# EAGLE design LB_BIT_i30_KEYBOARD-v03(3_4)-OHW (EAGLE 6.6.0)
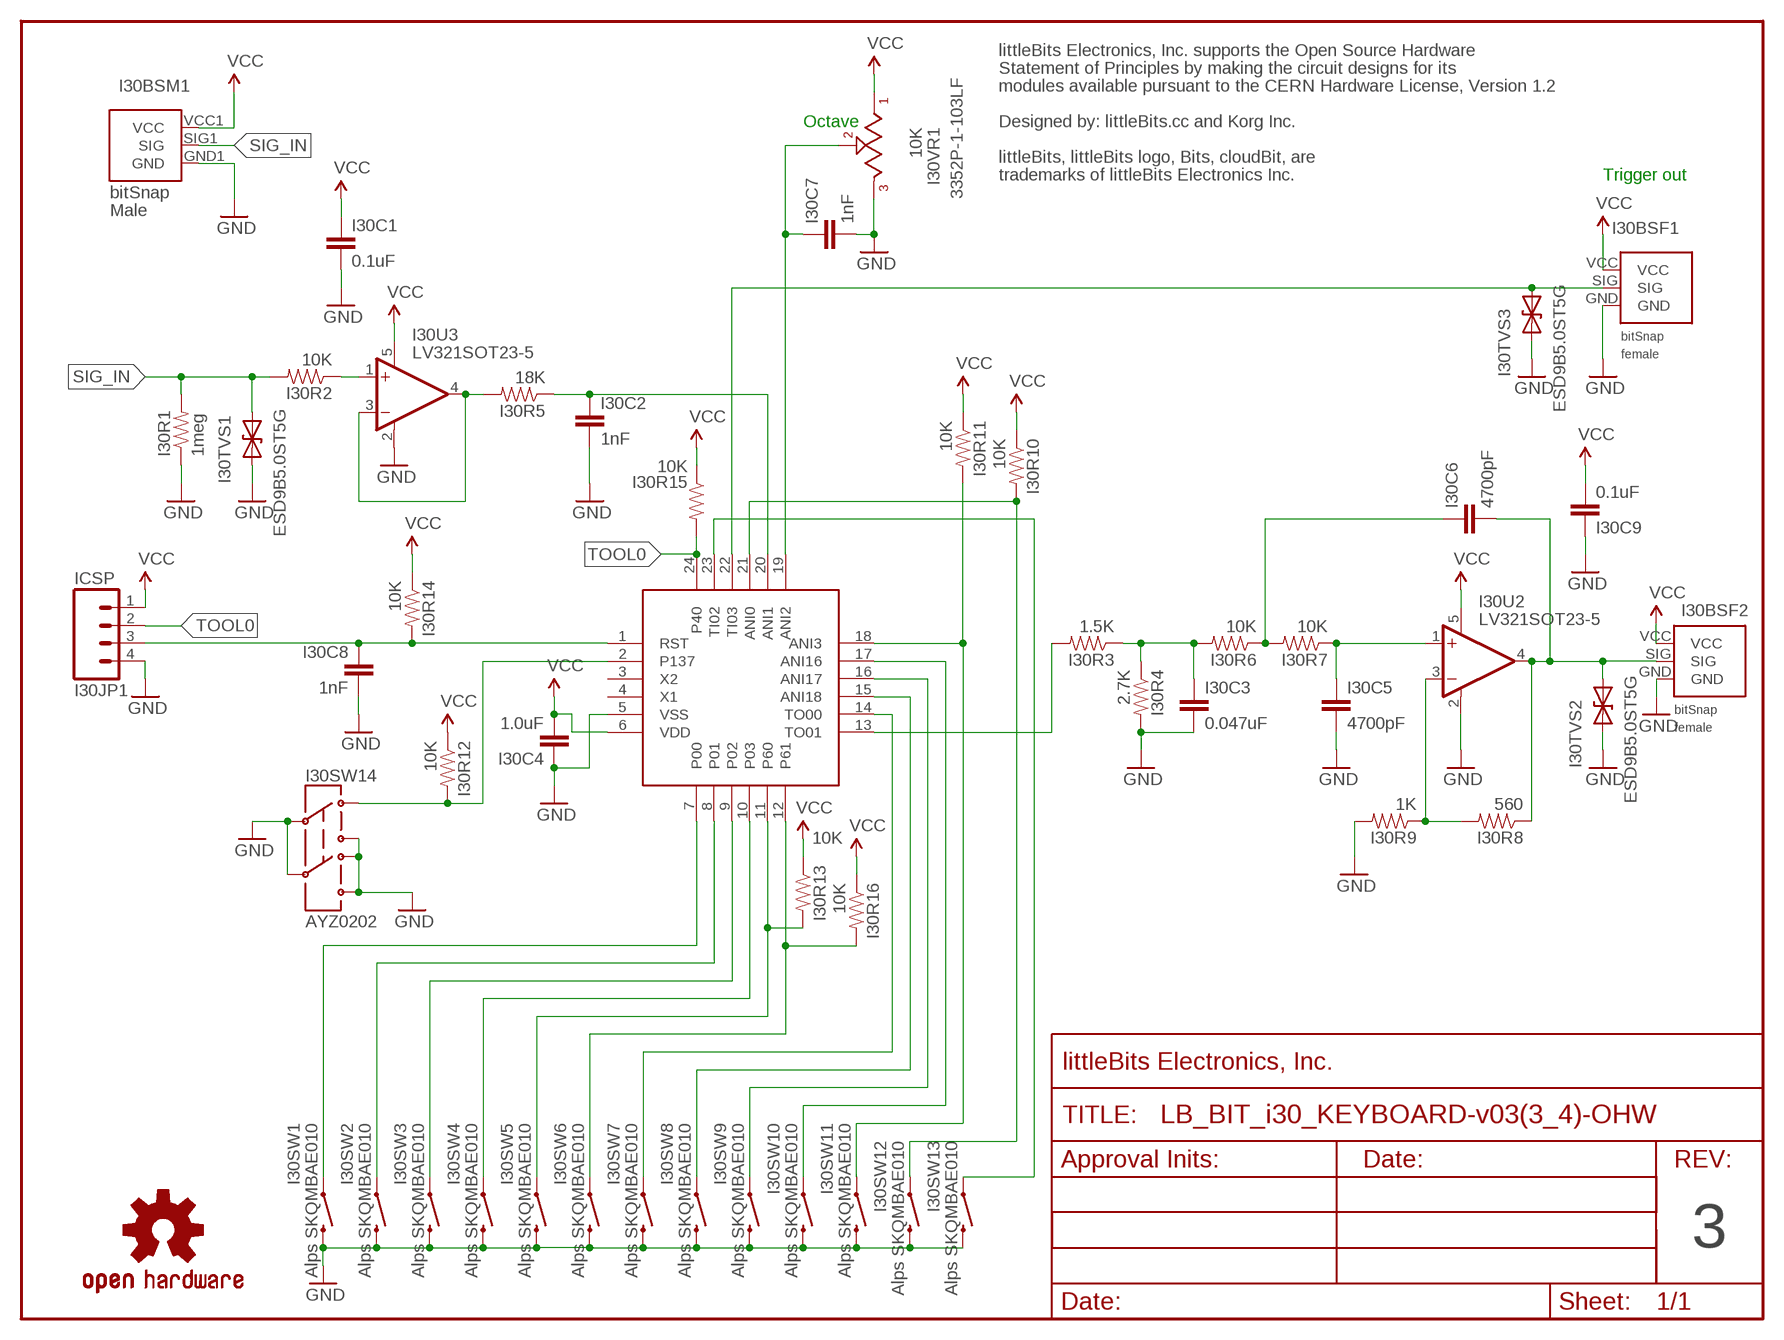
[diagram p0: schematic, sheet 1]

## Parts
FRAME1  FRAME-LETTER-OHWOHW  [FABDWG01-OHW]
I30BSF1  BITSNAP_V03_FEMALE  [BITSNAP_V03_FEMALE]
I30BSF2  BITSNAP_V03_FEMALE  [BITSNAP_V03_FEMALE]
I30BSM1  BITSNAP_V03_MALE  [BITSNAP_V03_MALE]
I30C1  0.1uF  CAPCAP-0603  [CAP-0603]
I30C2  1nF  CAPCAP-0603  [CAP-0603]
I30C3  0.047uF  CAPCAP-0603  [CAP-0603]
I30C4  1.0uF  CAPCAP-0603  [CAP-0603]
I30C5  4700pF  CAPCAP-0603  [CAP-0603]
I30C6  4700pF  CAPCAP-0603  [CAP-0603]
I30C7  1nF  CAPCAP-0603  [CAP-0603]
I30C8  1nF  CAPCAP-0603  [CAP-0603]
I30C9  0.1uF  CAPCAP-0603  [CAP-0603]
I30JP1  ICSP  HDR-4SM_SML  [SIP4-SM-0.1IN-NOS.S.]
I30R1  1meg  RESISTOR0603  [RES-0603]
I30R2  10K  RESISTOR0603  [RES-0603]
I30R3  1.5K  RESISTOR0603  [RES-0603]
I30R4  2.7K  RESISTOR0603  [RES-0603]
I30R5  18K  RESISTOR0603  [RES-0603]
I30R6  10K  RESISTOR0603  [RES-0603]
I30R7  10K  RESISTOR0603  [RES-0603]
I30R8  560  RESISTOR0603  [RES-0603]
I30R9  1K  RESISTOR0603  [RES-0603]
I30R10  10K  RESISTOR0603  [RES-0603]
I30R11  10K  RESISTOR0603  [RES-0603]
I30R12  10K  RESISTOR0603  [RES-0603]
I30R13  10K  RESISTOR0603  [RES-0603]
I30R14  10K  RESISTOR0603  [RES-0603]
I30R15  10K  RESISTOR0603  [RES-0603]
I30R16  10K  RESISTOR0603  [RES-0603]
I30SW1  Alps SKQMBAE010  SWITCH-MOMENTARY-2EVQ  [TACTILE-SWITCH-EVQ-PE104K]
I30SW2  Alps SKQMBAE010  SWITCH-MOMENTARY-2EVQ  [TACTILE-SWITCH-EVQ-PE104K]
I30SW3  Alps SKQMBAE010  SWITCH-MOMENTARY-2EVQ  [TACTILE-SWITCH-EVQ-PE104K]
I30SW4  Alps SKQMBAE010  SWITCH-MOMENTARY-2EVQ  [TACTILE-SWITCH-EVQ-PE104K]
I30SW5  Alps SKQMBAE010  SWITCH-MOMENTARY-2EVQ  [TACTILE-SWITCH-EVQ-PE104K]
I30SW6  Alps SKQMBAE010  SWITCH-MOMENTARY-2EVQ  [TACTILE-SWITCH-EVQ-PE104K]
I30SW7  Alps SKQMBAE010  SWITCH-MOMENTARY-2EVQ  [TACTILE-SWITCH-EVQ-PE104K]
I30SW8  Alps SKQMBAE010  SWITCH-MOMENTARY-2EVQ  [TACTILE-SWITCH-EVQ-PE104K]
I30SW9  Alps SKQMBAE010  SWITCH-MOMENTARY-2EVQ  [TACTILE-SWITCH-EVQ-PE104K]
I30SW10  Alps SKQMBAE010  SWITCH-MOMENTARY-2EVQ  [TACTILE-SWITCH-EVQ-PE104K]
I30SW11  Alps SKQMBAE010  SWITCH-MOMENTARY-2EVQ  [TACTILE-SWITCH-EVQ-PE104K]
I30SW12  Alps SKQMBAE010  SWITCH-MOMENTARY-2EVQ  [TACTILE-SWITCH-EVQ-PE104K]
I30SW13  Alps SKQMBAE010  SWITCH-MOMENTARY-2EVQ  [TACTILE-SWITCH-EVQ-PE104K]
I30SW14  AYZ0202  [AYZ0202]
I30TVS1  ESD9B5.0ST5G  DIODE-TVSSOD-923  [SOD-923]
I30TVS2  ESD9B5.0ST5G  DIODE-TVSSOD-923  [SOD-923]
I30TVS3  ESD9B5.0ST5G  DIODE-TVSSOD-923  [SOD-923]
I30U1  R5F10278QFN-24  [QFN-24(4MM)]
I30U2  LV321SOT23-5  [SOT23-5]
I30U3  LV321SOT23-5  [SOT23-5]
I30VR1  10K  THUMBPOT-BOURNS_3352P  [THUMBPOT-BOURNS_3352]
U$1  OSHW-LOGOL  [OSHW-LOGO-L]
U$2  OSHWCREDIT-KORG  [OSHWCREDIT-KORG]

## Nets
GND: I30BSF1.GND I30BSF2.GND I30BSM1.GND1(GND) I30C1.2 I30C2.2 I30C3.2 I30C4.1 I30C5.2 I30C7.2 I30C8.2 I30C9.1 I30JP1.4 I30R1.1 I30R4.2 I30R9.2 I30SW1.P$2 I30SW2.P$2 I30SW3.P$2 I30SW4.P$2 I30SW5.P$2 I30SW6.P$2 I30SW7.P$2 I30SW8.P$2 I30SW9.P$2 I30SW10.P$2 I30SW11.P$2 I30SW12.P$2 I30SW13.P$2 I30SW14.2 I30SW14.3 I30SW14.4 I30SW14.5 I30SW14.6 I30TVS1.1(A) I30TVS2.1(A) I30TVS3.1(A) I30U1.5(VSS) I30U2.2(V-) I30U3.2(V-) I30VR1.1
N$1: I30C2.1 I30R5.1 I30U1.20(ANI1)
N$2: I30R5.2 I30U3.3(-IN) I30U3.4(OUT)
N$3: I30C3.1 I30R3.1 I30R4.1 I30R6.2
N$4: I30R2.1 I30U3.1(+IN)
N$5: I30R3.2 I30U1.13(TO01)
N$6: I30R8.2 I30R9.1 I30U2.3(-IN)
N$7: I30C6.1 I30R6.1 I30R7.2
N$8: I30BSF1.SIG I30TVS3.2(C) I30U1.22(TI03)
N$9: I30SW13.P$1 I30U1.23(TI02)
N$10: I30C5.1 I30R7.1 I30U2.1(+IN)
N$11: I30R12.2 I30SW14.1 I30U1.2(P137)
N$12: I30R10.2 I30SW12.P$1 I30U1.21(ANI0)
N$13: I30R11.2 I30SW11.P$1 I30U1.18(ANI3)
N$14: I30SW10.P$1 I30U1.17(ANI16)
N$15: I30SW9.P$1 I30U1.16(ANI17)
N$16: I30SW8.P$1 I30U1.15(ANI18)
N$17: I30SW7.P$1 I30U1.14(TO00)
N$18: I30R16.2 I30SW6.P$1 I30U1.12(P61)
N$19: I30R13.2 I30SW5.P$1 I30U1.11(P60)
N$20: I30SW4.P$1 I30U1.10(P03)
N$21: I30SW3.P$1 I30U1.9(P02)
N$22: I30SW2.P$1 I30U1.8(P01)
N$23: I30SW1.P$1 I30U1.7(P00)
N$27: I30C7.1 I30U1.19(ANI2) I30VR1.2
N$31: I30C8.1 I30JP1.3 I30R14.2 I30U1.1(RST)
SIG_IN: I30BSM1.SIG1(SIG) I30R1.2 I30R2.2 I30TVS1.2(C)
SIG_OUT: I30BSF2.SIG I30C6.2 I30R8.1 I30TVS2.2(C) I30U2.4(OUT)
TOOL0: I30JP1.2 I30R15.2 I30U1.24(P40)
VCC: I30BSF1.VCC I30BSF2.VCC I30BSM1.VCC1(VCC) I30C1.1 I30C4.2 I30C9.2 I30JP1.1 I30R10.1 I30R11.1 I30R12.1 I30R13.1 I30R14.1 I30R15.1 I30R16.1 I30U1.6(VDD) I30U2.5(V+) I30U3.5(V+) I30VR1.3
Unconnected: I30U1.3(X2) I30U1.4(X1)

## Notes on the sheet
- Octave
- Trigger out
- 3352P-1-103LF
- 3

## Library data of the parts
FRAME1 = LITTLEBITS:FRAME-LETTER-OHW
I30BSF1 I30BSF2 = bitSnap:BITSNAP_V03_FEMALE
I30BSM1 = bitSnap:BITSNAP_V03_MALE
I30C1-I30C9 = LITTLEBITS:CAP
I30JP1 = LITTLEBITS:HDR-4: Header 4 Standard 4-pin 0.1" header. Use with straight break away headers (SKU : PRT-00116), right angle break away headers (PRT-00553), swiss pins (PRT-00743), machine pins (PRT-00117), and female headers (PRT-00115). Molex polarized connector foot print use with SKU : PRT-08231 with associated crimp pins and housings.
I30R1-I30R16 = LITTLEBITS:RESISTOR
I30SW1-I30SW13 = LITTLEBITS:SWITCH-MOMENTARY-2
I30SW14 = LITTLEBITS:AYZ0202
I30TVS1-I30TVS3 = LITTLEBITS:DIODE-TVS: Bidirectional Transient Voltage Suppression Diode: Device conducts in avalanche mode after reaching a part dependent voltage threshold. Used for limiting voltage spikes on ESD sensitive inputs and outputs.; IEC_ESD_PROT0: +/-18kV; LB_PN: ?; MPN: ESD9B5.0ST5G; V_CLAMP: ?; V_OPERATION: 5V
I30U1 = LITTLEBITS:R5F10278
I30U2 I30U3 = LITTLEBITS:LV321
I30VR1 = LITTLEBITS:THUMBPOT-BOURNS_3352
U$1 = LITTLEBITS:OSHW-LOGO: Open Source Hardware Logo This logo indicates the piece of hardware it is found on incorporates a OSHW license and/or adheres to the definition of open source hardware found here: http://freedomdefined.org/OSHW
U$2 = LITTLEBITS:OSHWCREDIT-KORG

## Board
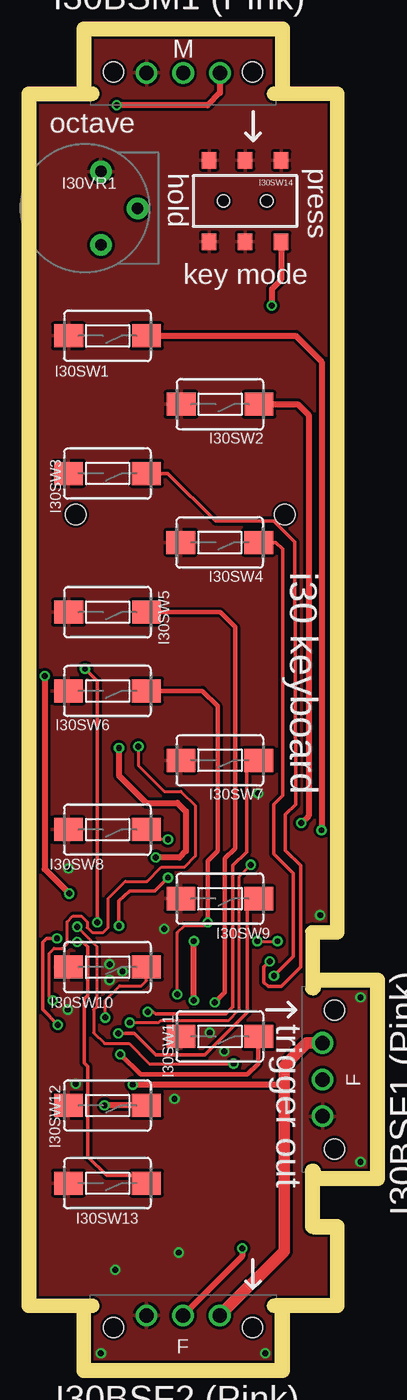
[diagram p1: board, top side]
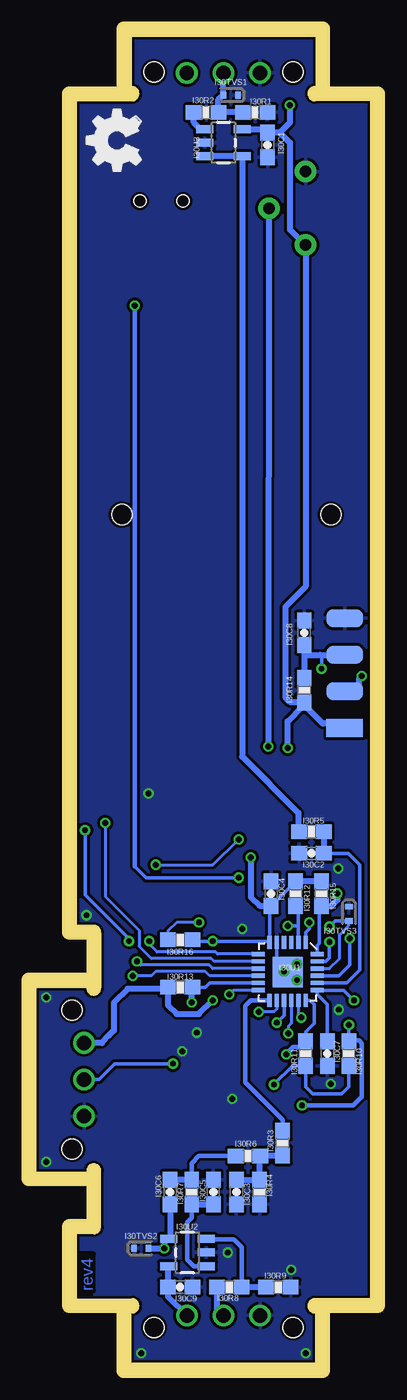
[diagram p2: board, bottom side, seen from below]

Size 23.2 x 92.1 mm. Coordinates in mm from the lower left corner, seen from the top.
Outline: 0,4.5 0,87.6
Outline: 20.4,87.6 20.4,30.4 19.2,30.4
Outline: 19.2,30.4 arc90 18.7,29.9 arc-90 19.2,30.4
Outline: 19.2,9 arc-90 18.7,9.5 arc90 19.2,9
Outline: 19.2,9 20.4,9 20.4,4.5
Copper layers (1*16): Top 0.035mm / dielectric 1.5mm / Bottom 0.035mm
Design rules "littleBitsDRC": minimum track width 0.2mm, minimum drill 0.4mm, track to track 0.2mm, track to pad 0.2mm, pad to pad 0.2mm, via to via 0.2mm, smd to smd 0mil, copper to edge 0.2mm, drill to drill 0.2mm, minimum pad ring 0.2mm, minimum via ring 0.15mm, stop-mask expansion 0.1mm, vias tented up to drill 0mil, thermal gap 0.2mm
Milling: 9 lines

### Footprints (pad centres in the part's own frame; a part is rotated, then mirrored left to right if it is on the bottom)
BITSNAP_V03_FEMALE = drill 1: GND 3.91,3.33; SIG 6.45,3.33; VCC 8.99,3.33 | hole 1.4: 1.63,2.5; 11.27,2.5
BITSNAP_V03_MALE = drill 1: GND1 8.98,2.56; SIG1 6.44,2.56; VCC1 3.9,2.56 | hole 1.4: 11.27,2.5; 1.63,2.5
CAP-0603 = smd 1.1 x 1: 1 -0.85,0; 2 0.85,0
SIP4-SM-0.1IN-NOS.S. = smd 1.27 x 2.54: 1 -3.81,0; 2 -1.27,0; 3 1.27,0; 4 3.81,0
RES-0603 = smd 1.1 x 1: 1 -0.85,0; 2 0.85,0
TACTILE-SWITCH-EVQ-PE104K = smd 2 x 1.6: P$1 -2.7,0; P$2 2.7,0
AYZ0202 = smd 1 x 1.15: 1 -2.5,2.825; 2 0,2.825; 3 2.5,2.825; 4 -2.5,-2.825; 5 0,-2.825; 6 2.5,-2.825 | hole 0.85: 1.5,0; -1.5,0
SOD-923 = smd 0.4 x 0.5: 1 -0.5,0; 2 0.5,0
QFN-24(4MM) = smd 0.9 x 0.3: 1 0,3.3; 2 0,2.8; 3 0,2.3; 4 0,1.8; 5 0,1.3; 6 0,0.8; 13 4,0.8; 14 4,1.3; 15 4,1.8; 16 4,2.3; 17 4,2.8; 18 4,3.3 | smd 0.3 x 0.9: 7 0.8,0; 8 1.3,0; 9 1.8,0; 10 2.3,0; 11 2.8,0; 12 3.3,0; 19 3.3,4.1; 20 2.8,4.1; 21 2.3,4.1; 22 1.8,4.1; 23 1.3,4.1; 24 0.8,4.1 | smd 2.1 x 2.1: EP 2.05,2.05
SOT23-5 = smd 0.55 x 1.2: 1 -0.95,-1.3; 2 0,-1.3; 3 0.95,-1.3; 4 0.95,1.3; 5 -0.95,1.3
THUMBPOT-BOURNS_3352 = drill 0.8 pad 1.5: 1 2.55,-1.1; 2 0,-3.65; 3 -2.55,-1.1
LB_PWR_LEGS = hole 1.4: 2.75,4.4; 17.25,4.4

### Placement (x,y rotation side)
FRAME1  58.7,43.05 0 top  (outside the outline)
I30BSF1  23.2,13.25 90 top
I30BSF2  3.75,0 0 top
I30BSM1  16.65,92.1 180 top
I30C1  7.14,84.54 270 bottom
I30C2  4.1,35.4 180 bottom
I30C3  9.3,11.9 270 bottom
I30C4  6.9,32.6 270 bottom
I30C5  10.9,11.9 90 bottom
I30C6  13.9,11.9 270 bottom
I30C7  3,21.5 270 bottom
I30C8  4.6,50.7 90 bottom
I30C9  13.2,5.3 180 bottom
I30JP1  1.8,47.9 90 bottom
I30R1  8,86.8 180 bottom
I30R2  11.4,86.8 0 bottom
I30R3  6.1,15.3 90 bottom
I30R4  7.7,11.9 270 bottom
I30R5  4.1,36.9 180 bottom
I30R6  8.5,14.4 0 bottom
I30R7  12.4,11.9 90 bottom
I30R8  9.8,5.3 0 bottom
I30R9  6.4,5.3 0 bottom
I30R10  1.5,21.5 90 bottom
I30R11  4.5,21.5 90 bottom
I30R12  5.2,32.6 270 bottom
I30R13  13.2,26.1 0 bottom
I30R14  4.6,46.7 90 bottom
I30R15  3.4,32.6 270 bottom
I30R16  13.2,29.4 180 bottom
I30SW1  4.96,71.3 180 top
I30SW2  12.76,66.55 180 top
I30SW3  4.95,61.75 180 top
I30SW4  12.74,56.96 180 top
I30SW5  4.96,52.13 180 top
I30SW6  4.95,46.66 180 top
I30SW7  12.75,41.85 180 top
I30SW8  4.95,37.04 180 top
I30SW9  12.75,32.25 180 top
I30SW10  4.95,27.5 180 top
I30SW11  12.75,22.69 180 top
I30SW12  4.95,17.9 180 top
I30SW13  4.95,12.51 180 top
I30SW14  14.5,80.65 180 top
I30TVS1  9.7,88 180 bottom
I30TVS2  15.9,8 0 bottom
I30TVS3  1.5,31.2 270 bottom
I30U1  7.8,29.2 270 bottom
I30U2  12.7,7.7 90 bottom
I30U3  10.2,84.7 270 bottom
I30VR1  3.4,80.15 90 top
U$1  33.1,-28.6 0 top  (outside the outline)
U$2  -19.2,-32.05 0 top  (outside the outline)
U$4  [LB_PWR_LEGS]  0,54.5 0 top
U$17  [OSHW_FILLX150_NOTEXT]  15.91,81.91 0 top

### Tracks (layer width: path | path; a pad name or v marks a point on that pad's centre or on a via)
GND  (via drill 0.41)
  Bottom 0.254: I30U1.5 6.5,28.1 6.1,27.7 v5.1,27.7
  other vias: 9.9,7.7 5.5,6.5 5.1,26.6 19.7,31.1 22.5,25.4 22.5,14 15.9,0.7 4.5,0.7 2.75,19.4 8.9,30.15 9.6,18.35 2.2,24.55 15.4,39.55 13.05,21.65 12.05,22.95 6,27.2 2.25,34.35
  pour Bottom: 0,0 0,92.1 23.2,92.1 23.2,0
  pour Top: 0,0 0,92.1 23.2,92.1 23.2,0
N$1
  Bottom 0.254: I30U1.20 1.65,26.4 0.75,27.3 0.75,34.6 1.55,35.4 I30C2.1
  Bottom 0.406: I30R5.1 I30C2.1
N$2
  Bottom 0.406: I30U3.3 I30U3.4 8.9,42.1 5,38.2 5,36.95 I30R5.2
N$3
  Bottom 0.406: I30C3.1 I30R4.1 7.7,14.35 I30R6.2 6.15,14.4 I30R3.1
N$4
  Bottom 0.254: I30U3.1 11.8,85.65
  Bottom 0.406: 11.8,85.65 12.25,86.1 I30R2.1
N$5
  Bottom 0.3: I30U1.13 8.3,25.2 8.7,24.8 8.7,19.5 6.1,16.9 I30R3.2
N$6
  Bottom 0.305: I30R8.2 8.95,8.05 9.5,8.6 11.35,8.6 I30U2.3
  Bottom 0.406: I30R9.1 I30R8.2
N$7
  Bottom 0.305: I30R6.1 11.9,14.4 12.4,13.9 I30R7.2
  Bottom 0.406: I30R7.2 I30C6.1
N$8  (via drill 0.41)
  Top 0.203: v2.85,30.3 4.2,28.95 4.2,24.75 4,24.55 4,22.95 4.75,22.2 6.45,22.2 7.85,20.8 v13.7,20.8
  Bottom 0.203: I30U1.22 2.85,27.4 2.15,28.1 2.15,29.75 1.5,30.4 I30TVS3.2
  Bottom 0.254: I30BSF1.SIG 18.8,19.7 17.75,20.8 v13.7,20.8 | I30TVS3.2 2.45,30.7 v2.85,30.3
N$9  (via drill 0.41)
  Top 0.254: v2.85,29.25 3.25,29.25 3.6,28.9 3.6,25.55 3.35,25.3 3.35,20.85 3.6,20.6 3.6,14.35 4.9,13.05 7.64,13.05 I30SW13.P$1
  Bottom 0.254: I30U1.23 3.1,27.9 2.85,28.15 v2.85,29.25
N$10
  Bottom 0.305: I30U2.1 12.25,6.75 12.7,7.2 12.7,9.8 12.4,10.1 I30R7.1
  Bottom 0.406: I30R7.1 I30C5.1
N$11  (via drill 0.41)
  Top 0.254: v5.75,30.35 5.75,32.1 6.5,32.8 8.25,32.8 v9.15,33.7
  Top 0.406: I30SW14.1 17,75.2 16.35,74.55 v16.35,73.4
  Bottom 0.254: I30U1.2 5,30.35 | 5,31.65 5,31.8 I30R12.2 5.25,31.9 5,31.65 | 5,31.65 5,30.35 | 5,30.35 v5.75,30.35 | v9.15,33.7 15.55,33.7 16.35,34.5
  Bottom 0.305: v16.35,73.4 16.35,34.5
N$12  (via drill 0.41)
  Top 0.254: v1.45,29.5 0.75,29.5 0.45,29.2 0.45,24.55 v1.5,23.5
  Top 0.406: I30SW12.P$1 v4.75,17.9
  Bottom 0.254: I30U1.21 2.2,26.9 1.45,27.65 v1.45,29.5 | v1.5,23.5 I30R10.2
  Bottom 0.305: v4.75,17.9 1.2,17.9 0.6,18.5 0.6,22.2 0.8,22.4 1.35,22.4 I30R10.2
N$13  (via drill 0.41)
  Top 0.305: v5.85,21.45 7.25,20.05 14.65,20.05 15.4,20.8 15.4,21.94 I30SW11.P$1
  Bottom 0.254: I30U1.18 4.2,25.2 3.9,24.9 3.9,23.6 4.5,23 I30R11.2
  Bottom 0.305: I30R11.2 4.95,21.95 5.35,21.95 v5.85,21.45
N$14  (via drill 0.41)
  Top 0.203: v4.8,24 4.8,25.2 5.8,26.2 7.3,26.2 7.65,26.55 7.65,27
  Top 0.305: 7.65,27 I30SW10.P$1
  Bottom 0.203: I30U1.17 5,24.2 v4.8,24
N$15  (via drill 0.41)
  Top 0.254: v5.7,22.9 6.8,22.9 8.3,21.4 11.7,21.4 14.65,24.35 14.65,31.55 14.85,31.7 15.4,31.7 I30SW9.P$1
  Bottom 0.203: I30U1.16 5.5,23.6 5.7,23.4 v5.7,22.9
N$16  (via drill 0.41)
  Top 0.203: v6.5,23.65 8.5,23.65 8.65,23.8 13.35,23.8 14.1,24.55 14.1,33.8 v14.9,34.6 | v9.15,36.35 7.66,36.35 I30SW8.P$1
  Bottom 0.203: v14.9,34.6 10.95,34.6 v9.15,36.35
  Bottom 0.254: I30U1.15 6,24.15 v6.5,23.65
N$17  (via drill 0.41)
  Top 0.203: v7.75,24.4 8.1,24.4
  Top 0.254: I30SW7.P$1 15.3,41.15 14.6,41.15 14.6,35.5 13.65,34.55 13.65,24.75 13.15,24.25 8.3,24.25 8.1,24.4
  Bottom 0.203: I30U1.14 6.5,24.6 6.7,24.4 v7.75,24.4
N$18  (via drill 0.41)
  Top 0.203: v9.8,25.6 9.8,29.9 10.3,30.4 11.7,30.4 v11.9,30.6
  Top 0.305: I30SW6.P$1 11.54,46.66 12.6,45.6 12.6,35.55 11.9,34.85 v11.9,30.6
  Bottom 0.203: I30U1.12 9.5,25.9 v9.8,25.6 | v11.9,30.6 13.45,30.6 14.05,30 I30R16.2
N$19  (via drill 0.41)
  Top 0.305: I30SW5.P$1 12.77,52.13 13.8,51.1 13.8,35.75 13.1,35.05 13.1,25.75 v12.4,25.05
  Bottom 0.254: I30U1.11 11.15,26.4 11.45,26.1 I30R13.2
  Bottom 0.406: v12.4,25.05 12.4,26.35 I30R13.2
N$20  (via drill 0.41)
  Top 0.254: I30SW4.P$1 16.64,56.96 17.1,56.5 17.1,39.4 16.5,38.8 16.5,35.35 17.85,34 17.85,28.25 v16.5,26.9
  Bottom 0.203: I30U1.10 11.15,26.9 11.45,27.2 14.9,27.2 15.2,26.9 v16.5,26.9
N$21  (via drill 0.41)
  Top 0.254: I30SW3.P$1 9.15,61.75 12.45,58.45 16.5,58.45 17.95,57 18,38.8 17.3,38.1 17.3,35.6 18.35,34.55 18.35,27.5 17,26.15 16.1,26.15 15.8,26.45 15.8,27.5 v16.2,27.9
  Bottom 0.203: I30U1.9 10.95,27.4 11.2,27.65 15.95,27.65 v16.2,27.9
N$22  (via drill 0.41)
  Top 0.406: I30SW2.P$1 18.15,66.55 18.9,65.8 18.9,38 v18.4,37.5
  Bottom 0.203: v18.4,37.5 18.4,32.4 16.05,30.05 16.05,28.95 15.2,28.1 11.05,28.1 10.85,27.9 I30U1.8
N$23  (via drill 0.41)
  Top 0.203: v15.35,29.3 v16.75,29.3
  Top 0.406: I30SW1.P$1 18,71.3 19.8,69.5 v19.8,37
  Bottom 0.203: I30U1.7 10.6,28.4 10.75,28.55 14.8,28.55 15.35,29.1 v15.35,29.3
  Bottom 0.254: v19.8,37 19.8,32.5 16.75,29.45 v16.75,29.3
N$27  (via drill 0.41)
  Top 0.203: v7.1,42.8 7.1,41.5 8.9,39.7 10.05,39.7 11.05,38.7 11.05,35.2 10.3,34.45 8.7,34.45 7.7,33.45 6.2,33.45 5,32.25 5,30.25 4.65,29.9 3.9,29.9 3.55,30.25 3.55,30.65 3.15,31.05 2.55,31.05 2.15,30.65 2.15,29.1 1.85,28.8 1.25,28.8 0.9,28.45 0.9,25.45 v1.15,25.2
  Bottom 0.254: I30C7.1 3,24.9 3.7,25.6 I30U1.19 1.85,25.9 v1.15,25.2
  Bottom 0.406: I30VR1.2 v7.1,42.8
N$31  (via drill 0.41)
  Top 0.254: v4.25,30.6 4.25,47.35 v3.4,48.2
  Bottom 0.254: I30U1.1 4.5,29.9 4.25,30.15 v4.25,30.6 | v3.4,48.2 3.4,49.07 3.5,49.17
  Bottom 0.406: I30R14.2 I30C8.1 4.58,49.17 3.5,49.17 I30JP1.3
SIG_IN
  Bottom 0.406: I30R1.2 I30R2.2 10.55,87.7 I30TVS1.2 10.2,89.63 I30BSM1.SIG1
SIG_OUT  (via drill 0.41)
  Top 0.406: v14.3,8 14.3,7.43 I30BSF2.SIG
  Bottom 0.406: I30C6.2 13.9,8.65 | 13.9,8.65 arc-90 I30U2.4 | I30R8.1 10.65,3.78 I30BSF2.SIG | 13.9,8.65 14.3,8.65 v14.3,8 I30TVS2.2
TOOL0  (via drill 0.41)
  Top 0.406: v0.6,47.7 0.6,34.3 v2.3,32.6
  Bottom 0.254: 3.55,31.7 3.55,29.15 3.7,29 I30U1.24
  Bottom 0.406: I30JP1.2 0.87,46.63 0.8,46.7 0.8,47.5 v0.6,47.7 | v2.3,32.6 2.3,32.15 2.75,31.7 3.55,31.7 I30R15.2
VCC  (via drill 0.41)
  Top 0.406: I30BSM1.VCC1 12.75,88.15 11.9,87.3 v5.6,87.3 | v5.75,42.7 5.75,40.8 7.65,38.9 9.8,38.9 10.4,38.3 10.4,35.55 9.95,35.1 v8.3,35.1 | v10.95,25.2 v10.95,29.3 | v6.7,19.35 17.2,19.35
  Top 0.813: I30BSF2.VCC 17.2,7.79 17.2,19.35 17.2,20.65 18.79,22.24 I30BSF1.VCC
  Bottom 0.203: v10.95,29.3 10.9,29.3
  Bottom 0.254: 7,29.3 7,31.45 I30C4.2 I30R12.1 | I30U1.6 7,29.3 | 7,29.3 10.9,29.3 12.1,29.3 12.2,29.4 I30R16.1 | I30R10.1 1.5,19.2 2,18.7 4,18.7 4.5,19.2 I30R11.1 5.4,20.65 v6.7,19.35
  Bottom 0.305: I30R13.1 14.45,26
  Bottom 0.406: I30U2.5 arc-90 14.05,6.7 I30C9.2 14.05,4.64 I30BSF2.VCC | v5.75,42.7 5.75,44.55 4.7,45.6 I30R14.1 | I30JP1.1 2.11,44.4 3.3,44.4 4.6,45.7 I30R14.1 | v5.6,87.3 5.6,86.1 6.3,85.4 | 6.3,85.4 I30C1.1 7.4,85.65 I30U3.5 | 6.3,85.4 5.6,84.7 5.6,78.65 I30VR1.3 4.5,53.9 5.9,52.5 5.9,46.2 5.6,45.9 4.65,45.9 I30R14.1 | I30R15.1 I30R12.1 | 14.45,26 16.85,26 17.8,25.05 17.8,23.1 18.15,22.75 18.64,22.24 I30BSF1.VCC | v8.3,35.1 8.3,32.35 7.7,31.75 I30C4.2 | I30R13.1 14.05,24.85 13.45,24.25 11.9,24.25 v10.95,25.2

### Text on the board
Bottom: rev4
tPlace: octave | hold | press | key mode | i30 keyboard | trigger out
tNames: I30BSM1 (Pink) | I30BSF1 (Pink) | I30BSF2 (Pink)
Milling: 1mm DIA. ROUTER PATH
dxf: 4